# EAGLE schematic LED-Test-Board v13 (EAGLE 9.7.0)

## Sheet 1 of 2
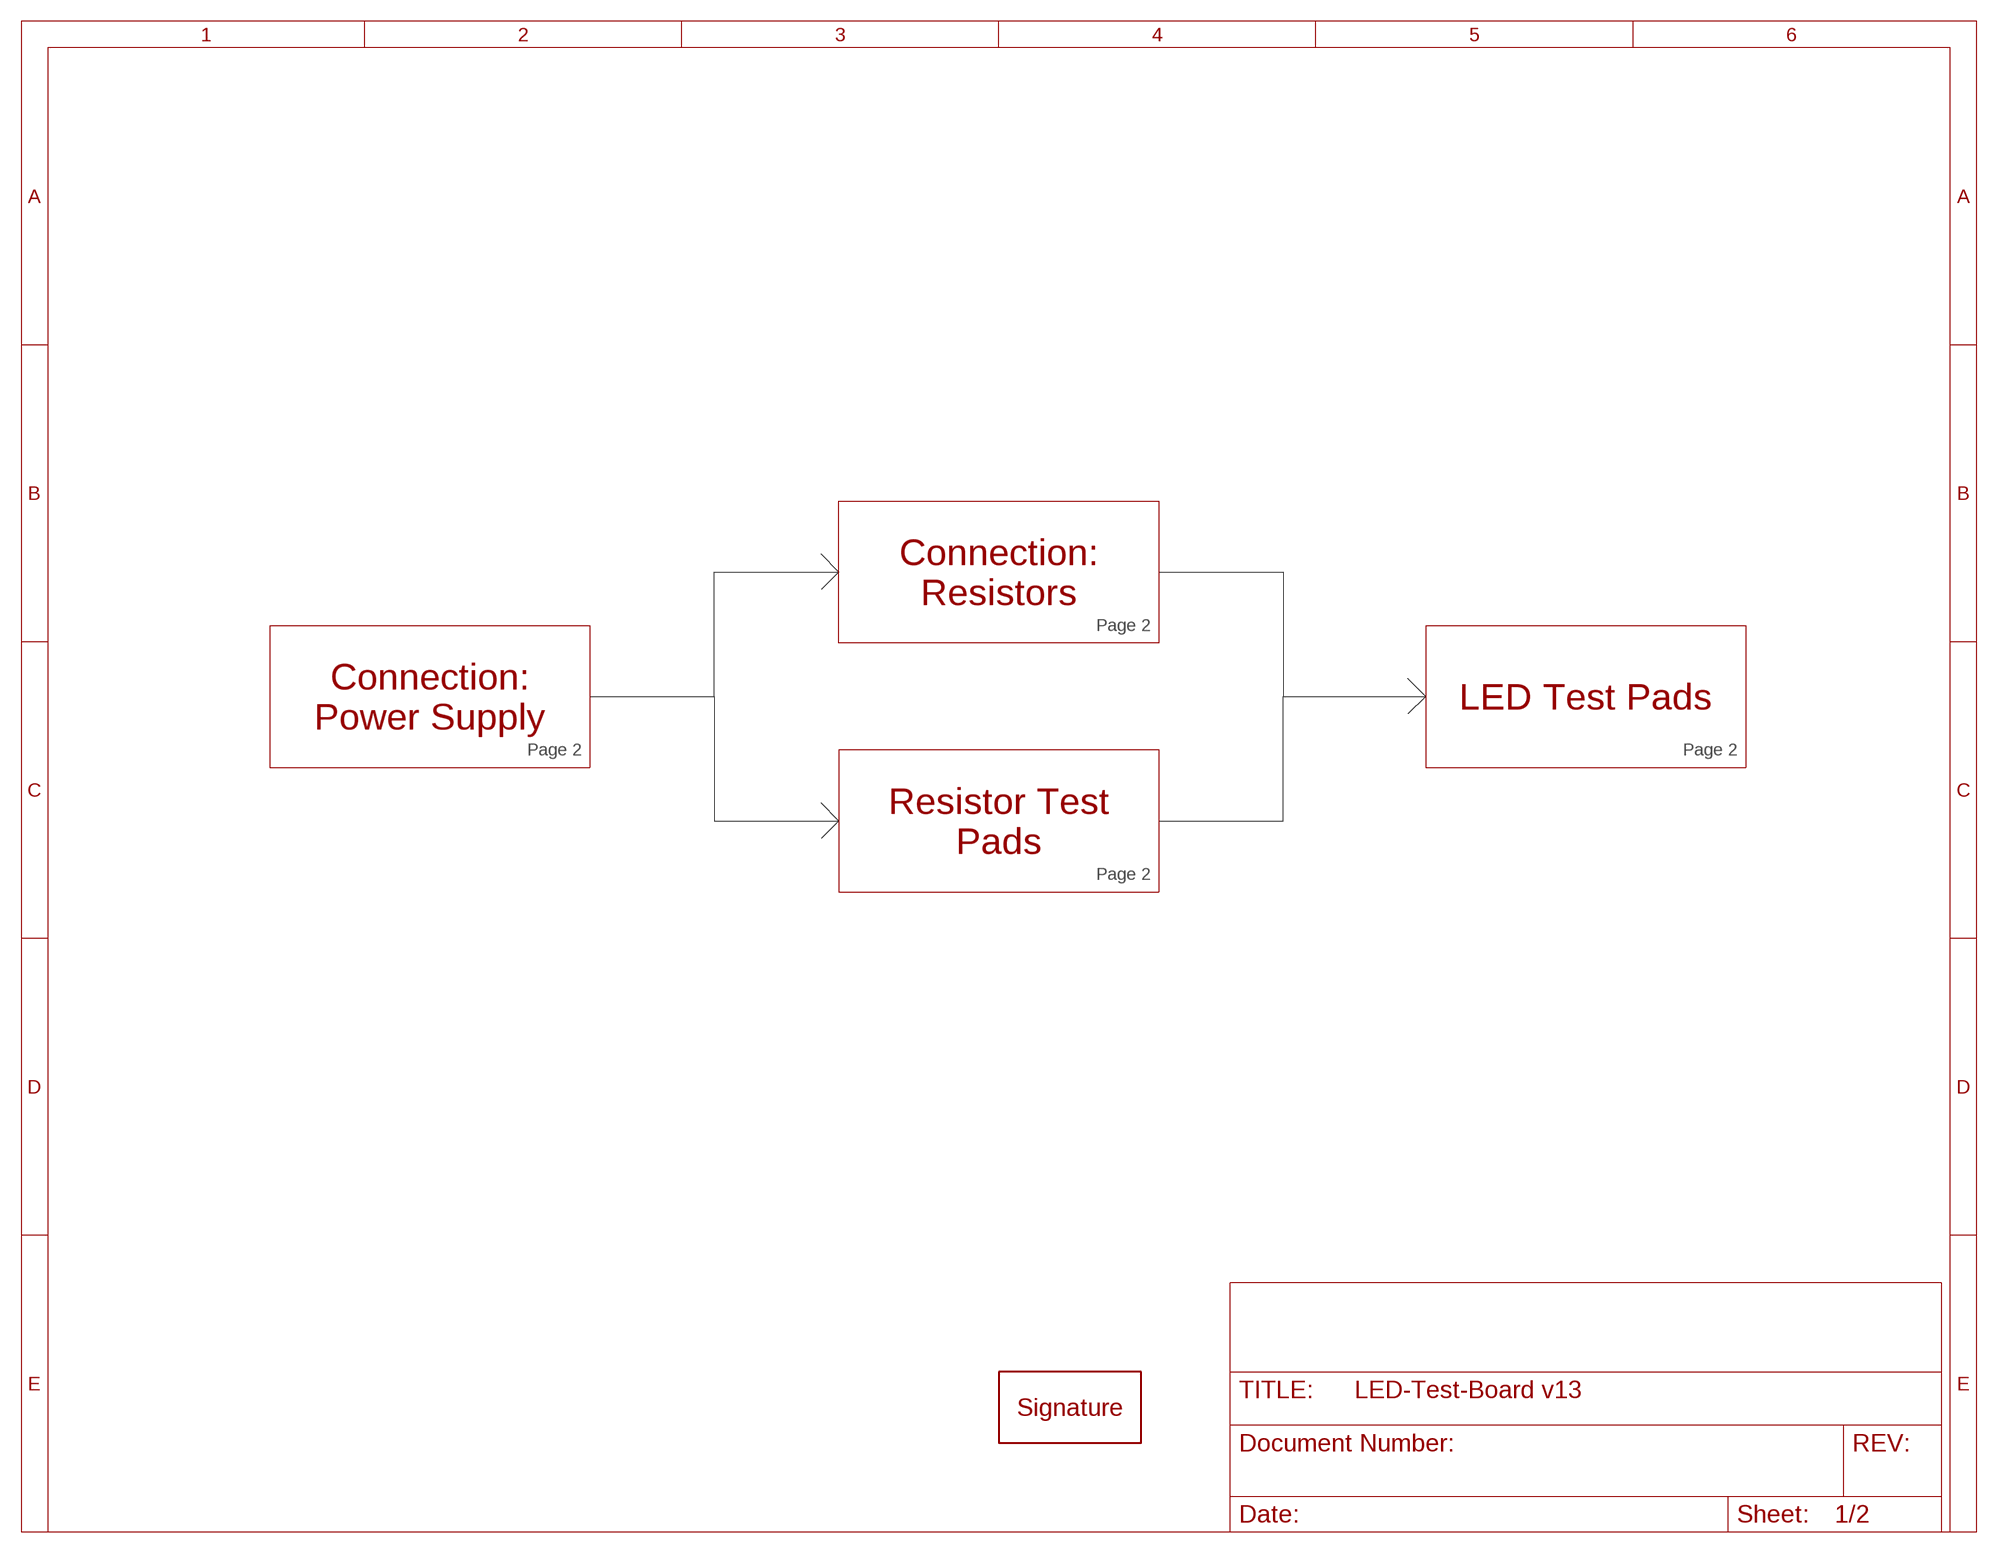
[diagram p0: schematic, sheet 1]

### Parts
U$5  SIGNATURE  [SIGNATURE]

### Notes on the sheet
- Connection:
  Resistors
- Page 2
- Connection:
  Power Supply
- LED Test Pads
- Page 2 | Page 2
- Resistor Test
  Pads
- Page 2

## Sheet 2 of 2
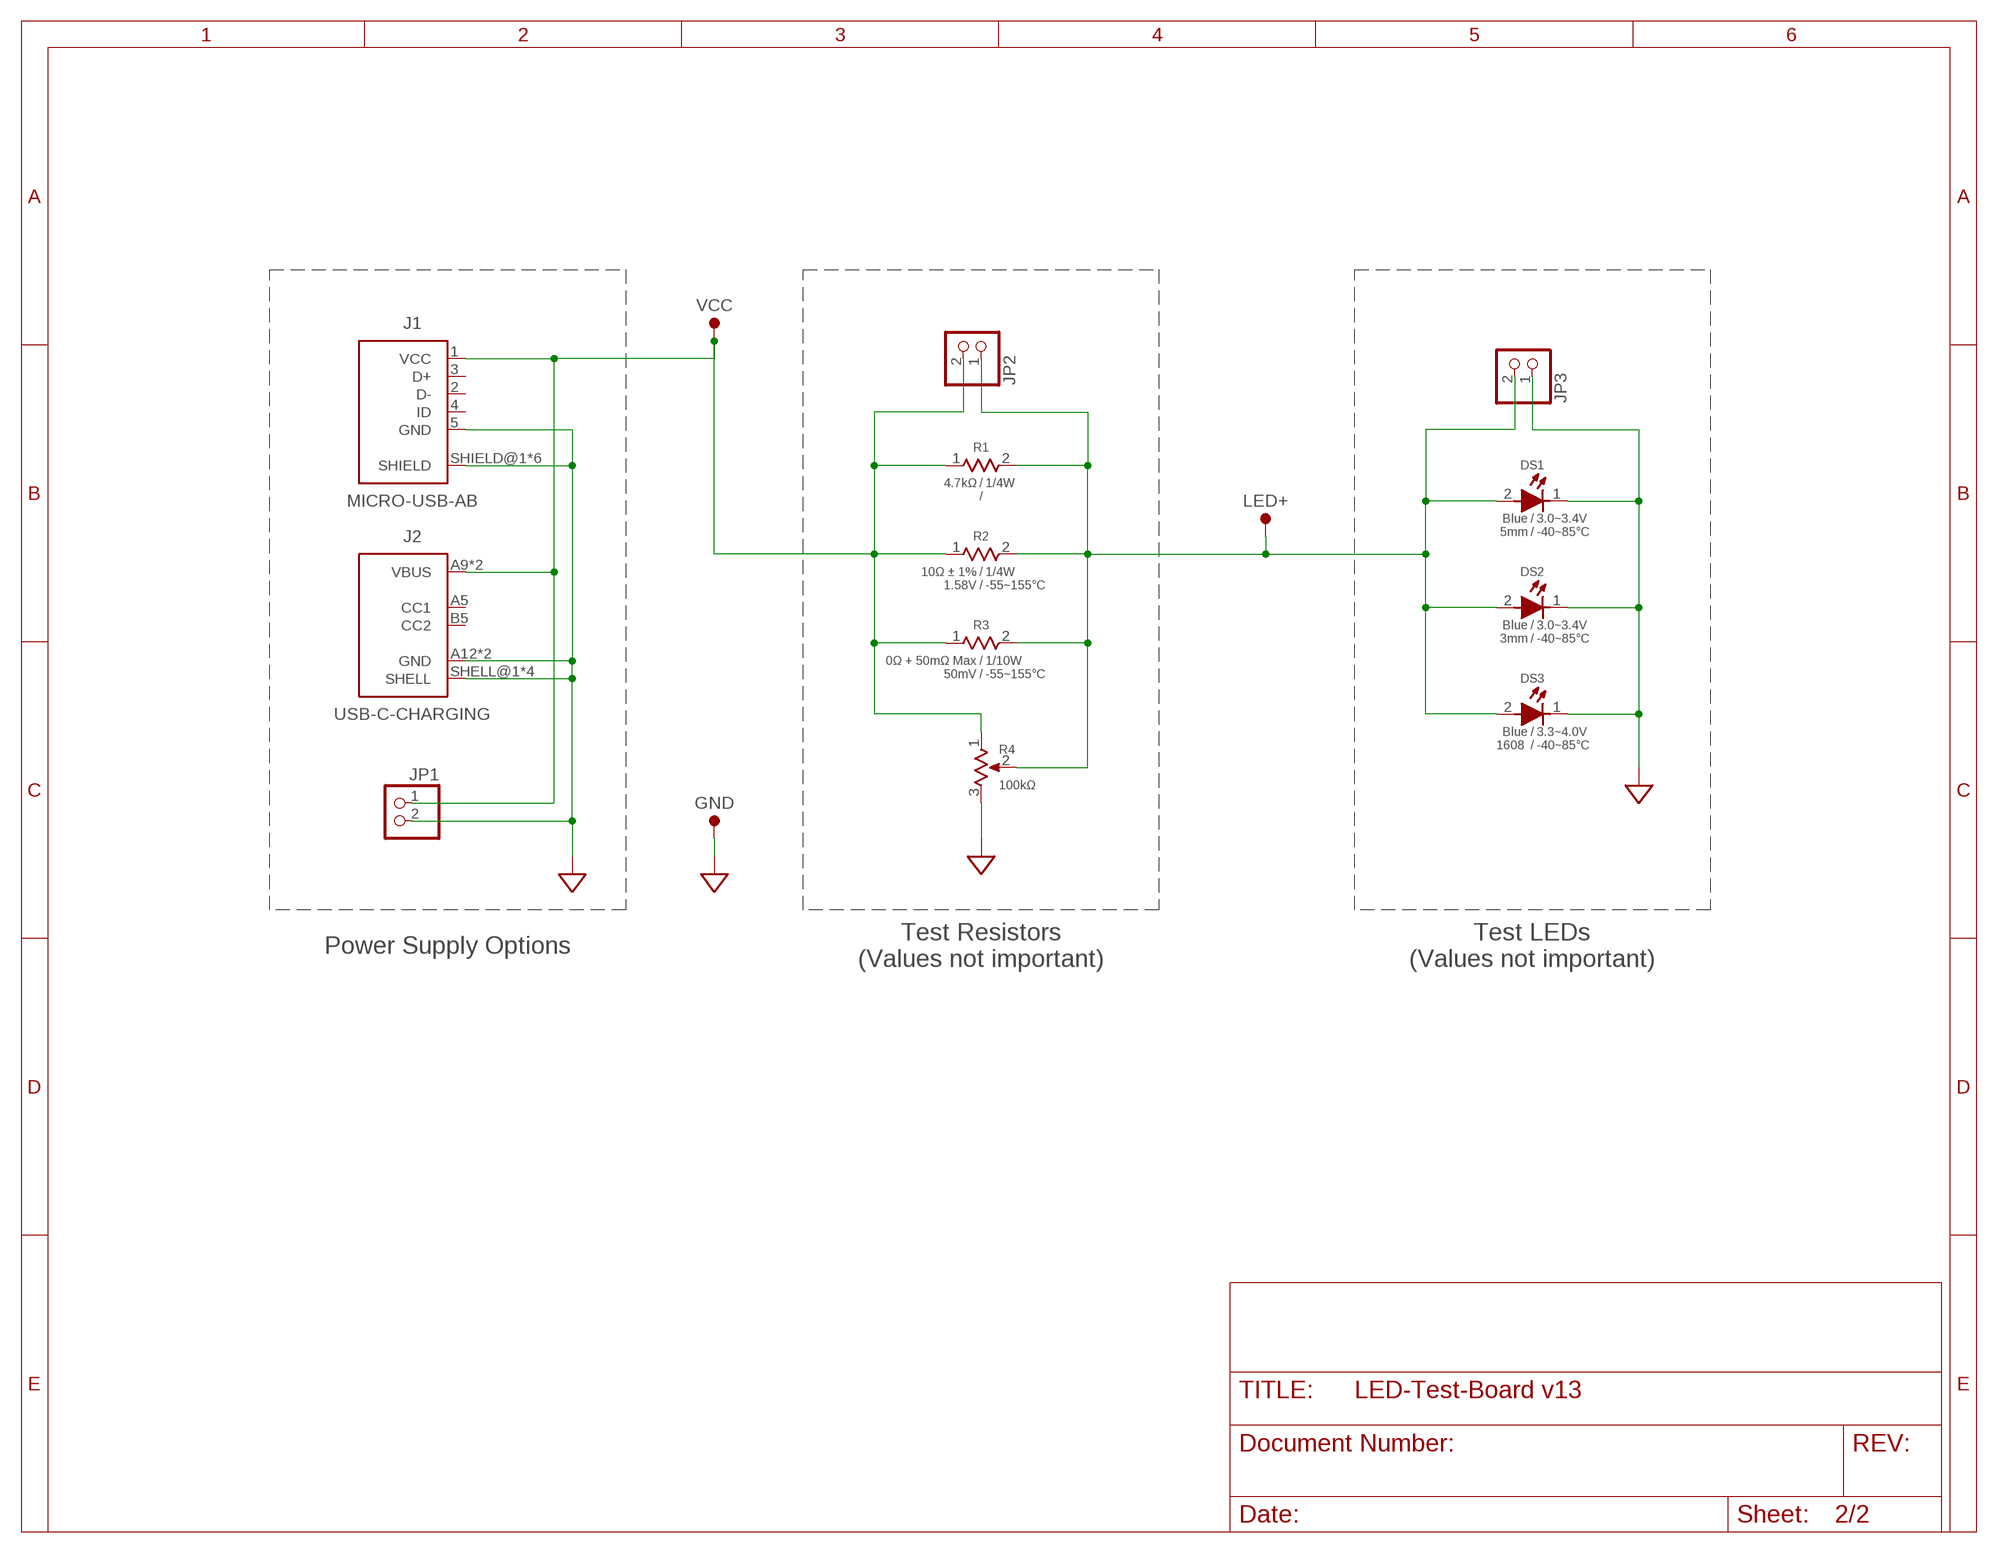
[diagram p1: schematic, sheet 2]

### Parts
DS1  Blue  LED-H-BLUE-5MM-TH  [5MM-TH]
DS2  Blue  LED-H-BLUE-3MM-TH  [3MM-TH]
DS3  Blue  LED-H-BLUE-1608  [1608]
GND  TEST-POINT  [TEST-POINT]
J1  MICRO-USB-AB  [47589-0001]
J2  USB-C-CHARGING  [USB-4125]
JP1  PINHD-1X2  [1X02]
JP2  PINHD-1X2  [1X02]
JP3  PINHD-1X2  [1X02]
LED+  TEST-POINT  [TEST-POINT]
R1  4.7kΩ  RES-H1/4W-TH  [1/4W-TH]
R2  10Ω ± 1%  RES-H-10R-3216  [3216-SEM]
R3  0Ω + 50mΩ Max  RES-H-0R-1608  [1608-SEM]
R4  100kΩ  TRIMPOT-V-100K  [3314J]
VCC  TEST-POINT  [TEST-POINT]

### Nets
GND: DS1.1 DS2.1 DS3.1 GND.TP J1.5(GND) J1.SHIELD@1(SHIELD) J1.SHIELD@2(SHIELD) J1.SHIELD@3(SHIELD) J1.SHIELD@4(SHIELD) J1.SHIELD@5(SHIELD) J1.SHIELD@6(SHIELD) J2.A12(GND) J2.B12(GND) J2.SHELL@1(SHELL) J2.SHELL@2(SHELL) J2.SHELL@3(SHELL) J2.SHELL@4(SHELL) JP1.2 JP3.1 R4.3
RES_OUT: DS1.2 DS2.2 DS3.2 JP2.1 JP3.2 LED+.TP R1.2 R2.2 R3.2 R4.2
VCC: J1.1(VCC) J2.A9(VBUS) J2.B9(VBUS) JP1.1 JP2.2 R1.1 R2.1 R3.1 R4.1 VCC.TP
Unconnected: J1.2(D-) J1.3(D+) J1.4(ID) J2.A5(CC1) J2.B5(CC2)

### Notes on the sheet
- Power Supply Options
- Test Resistors
  (Values not important)
- Test LEDs
  (Values not important)

## Library data of the parts
DS1 = Harrington-Diodes:LED-H: LEDs Kingbright - Horizontal; SIZE: 5mm; TEMPERATURE: -40~85°C; VOLTAGE: 3.0~3.4V
DS2 = Harrington-Diodes:LED-H: LEDs Kingbright - Horizontal; SIZE: 3mm; TEMPERATURE: -40~85°C; VOLTAGE: 3.0~3.4V
DS3 = Harrington-Diodes:LED-H: LEDs Kingbright - Horizontal; SIZE: 1608; TEMPERATURE: -40~85°C; VOLTAGE: 3.3~4.0V
GND LED+ VCC = Harrington-Symbols:TEST-POINT: Test point
J1 = Harrington-Connectors:MICRO-USB-AB: Micro USB AB Molex
J2 = Harrington-Connectors:USB-C-CHARGING: USB-C Charging Only GCT - Max Current: 3A
JP1-JP3 = pinhead:PINHD-1X2: PIN HEADER
R1 = Harrington-Resistors:RES-H: Resistors - Horizontal; POWER: 1/4W
R2 = Harrington-Resistors:RES-H: Resistors - Horizontal; POWER: 1/4W; TEMPERATURE: -55~155°C; VOLTAGE: 1.58V
R3 = Harrington-Resistors:RES-H: Resistors - Horizontal; POWER: 1/10W; TEMPERATURE: -55~155°C; VOLTAGE: 50mV
R4 = Harrington-Resistors:TRIMPOT-V: Trimming Potentiometers Bourns - Vertical
U$5 = Harrington-Aesthetics:SIGNATURE: PCB Signature